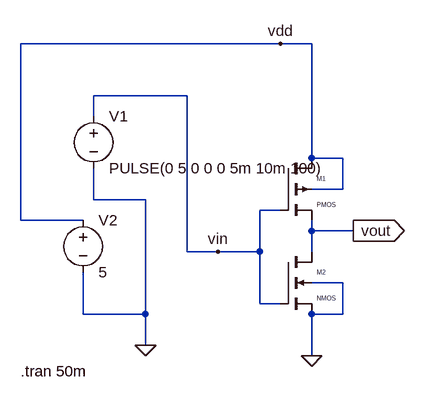
[diagram p0: schematic cmos inveter.asc]
cmos inveter.asc, the LTspice schematic file:
Version 4.1
SHEET 1 880 680
WIRE 144 -112 -256 -112
WIRE 192 -112 144 -112
WIRE 0 -32 -144 -32
WIRE -144 0 -144 -32
WIRE 192 64 192 -112
WIRE 240 64 192 64
WIRE 240 112 240 64
WIRE 240 112 192 112
WIRE -144 128 -144 80
WIRE -64 128 -144 128
WIRE 144 144 112 144
WIRE -256 160 -256 -112
WIRE -160 160 -256 160
WIRE 192 176 192 160
WIRE 256 176 192 176
WIRE 0 208 0 -32
WIRE 48 208 0 208
WIRE 112 208 112 144
WIRE 112 208 48 208
WIRE 192 208 192 176
WIRE 240 256 192 256
WIRE 112 288 112 208
WIRE 144 288 112 288
WIRE -160 304 -160 240
WIRE -64 304 -64 128
WIRE -64 304 -160 304
WIRE 240 304 240 256
WIRE 240 304 192 304
WIRE -64 352 -64 304
WIRE 192 368 192 304
FLAG 256 176 vout
IOPIN 256 176 Out
FLAG 192 368 0
FLAG -64 352 0
FLAG 48 208 vin
FLAG 144 -112 vdd
SYMBOL pmos4 144 64 R0
WINDOW 0 56 32 Left 0
WINDOW 3 56 72 Left 0
SYMATTR InstName M1
SYMBOL nmos4 144 208 R0
WINDOW 0 56 32 Left 0
WINDOW 3 56 72 Left 0
SYMATTR InstName M2
SYMBOL voltage -144 -16 R0
WINDOW 123 0 0 Left 0
WINDOW 39 0 0 Left 0
SYMATTR InstName V1
SYMATTR Value PULSE(0 5 0 0 0 5m 10m 100)
SYMBOL voltage -160 144 R0
SYMATTR InstName V2
SYMATTR Value 5
TEXT -256 392 Left 2 !.tran 50m

The netlist it stands for:
* cmos inveter.asc
M1 vdd vin vout vdd PMOS
M2 vout vin 0 0 NMOS
V1 vin 0 PULSE(0 5 0 0 0 5m 10m 100)
V2 vdd 0 5
.model NMOS NMOS
.model PMOS PMOS
.lib standard.mos
.tran 50m
.backanno
.end